# EAGLE design avoccado-avr-pcb-felina-screwholes (EAGLE 7.2.0)
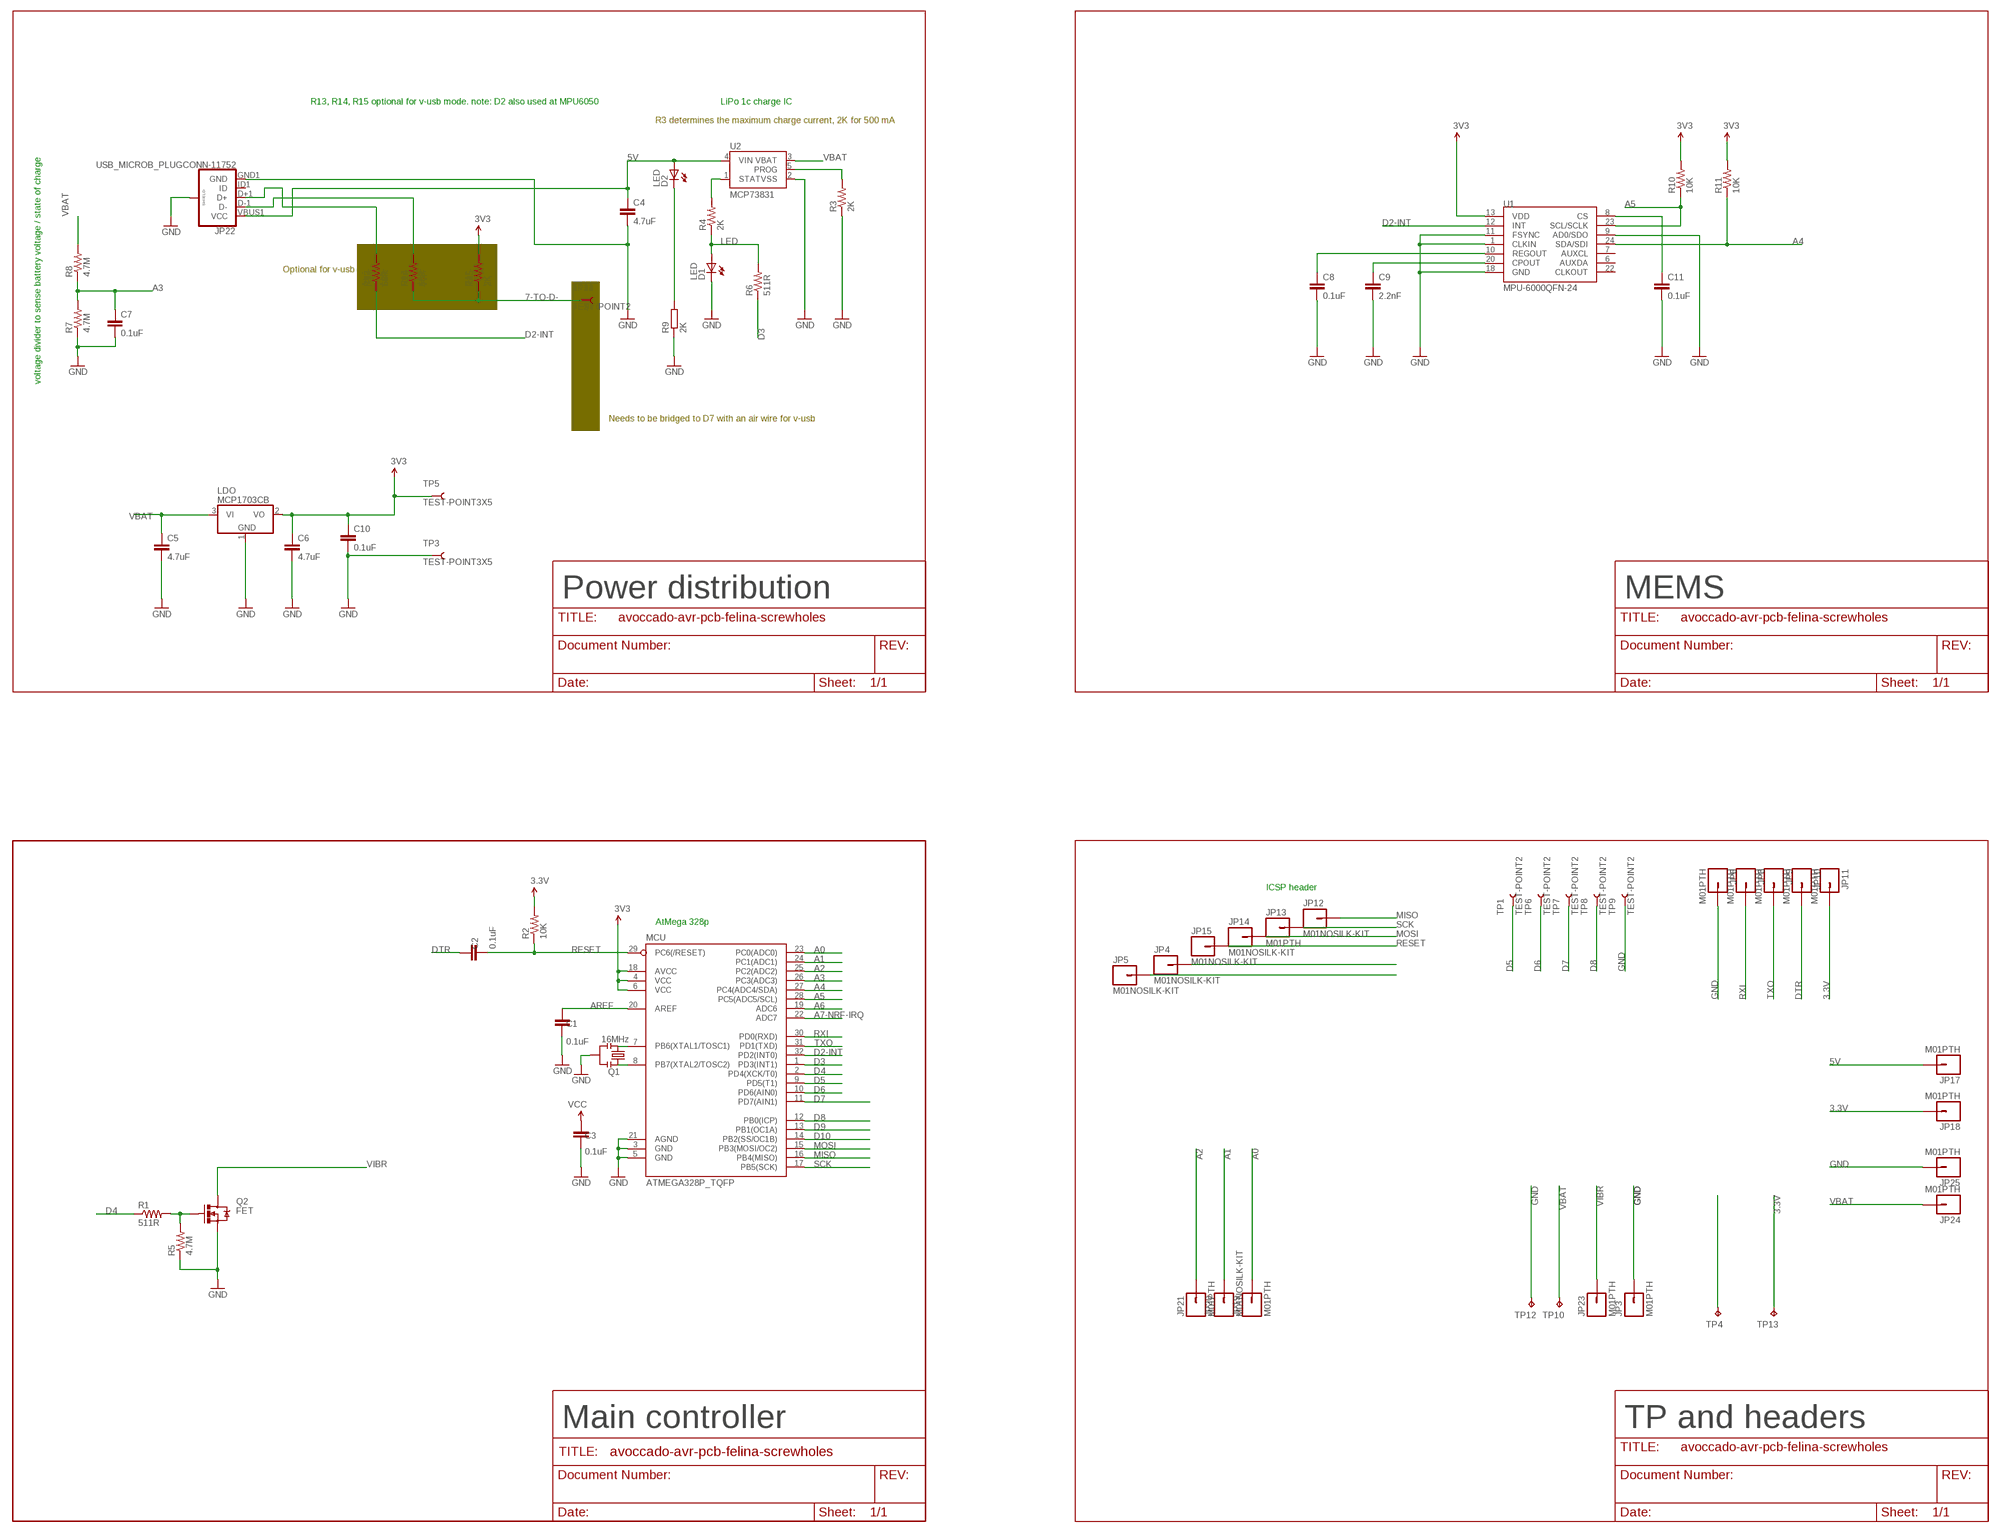
[diagram p0: schematic, sheet 1, part 1 of 2]
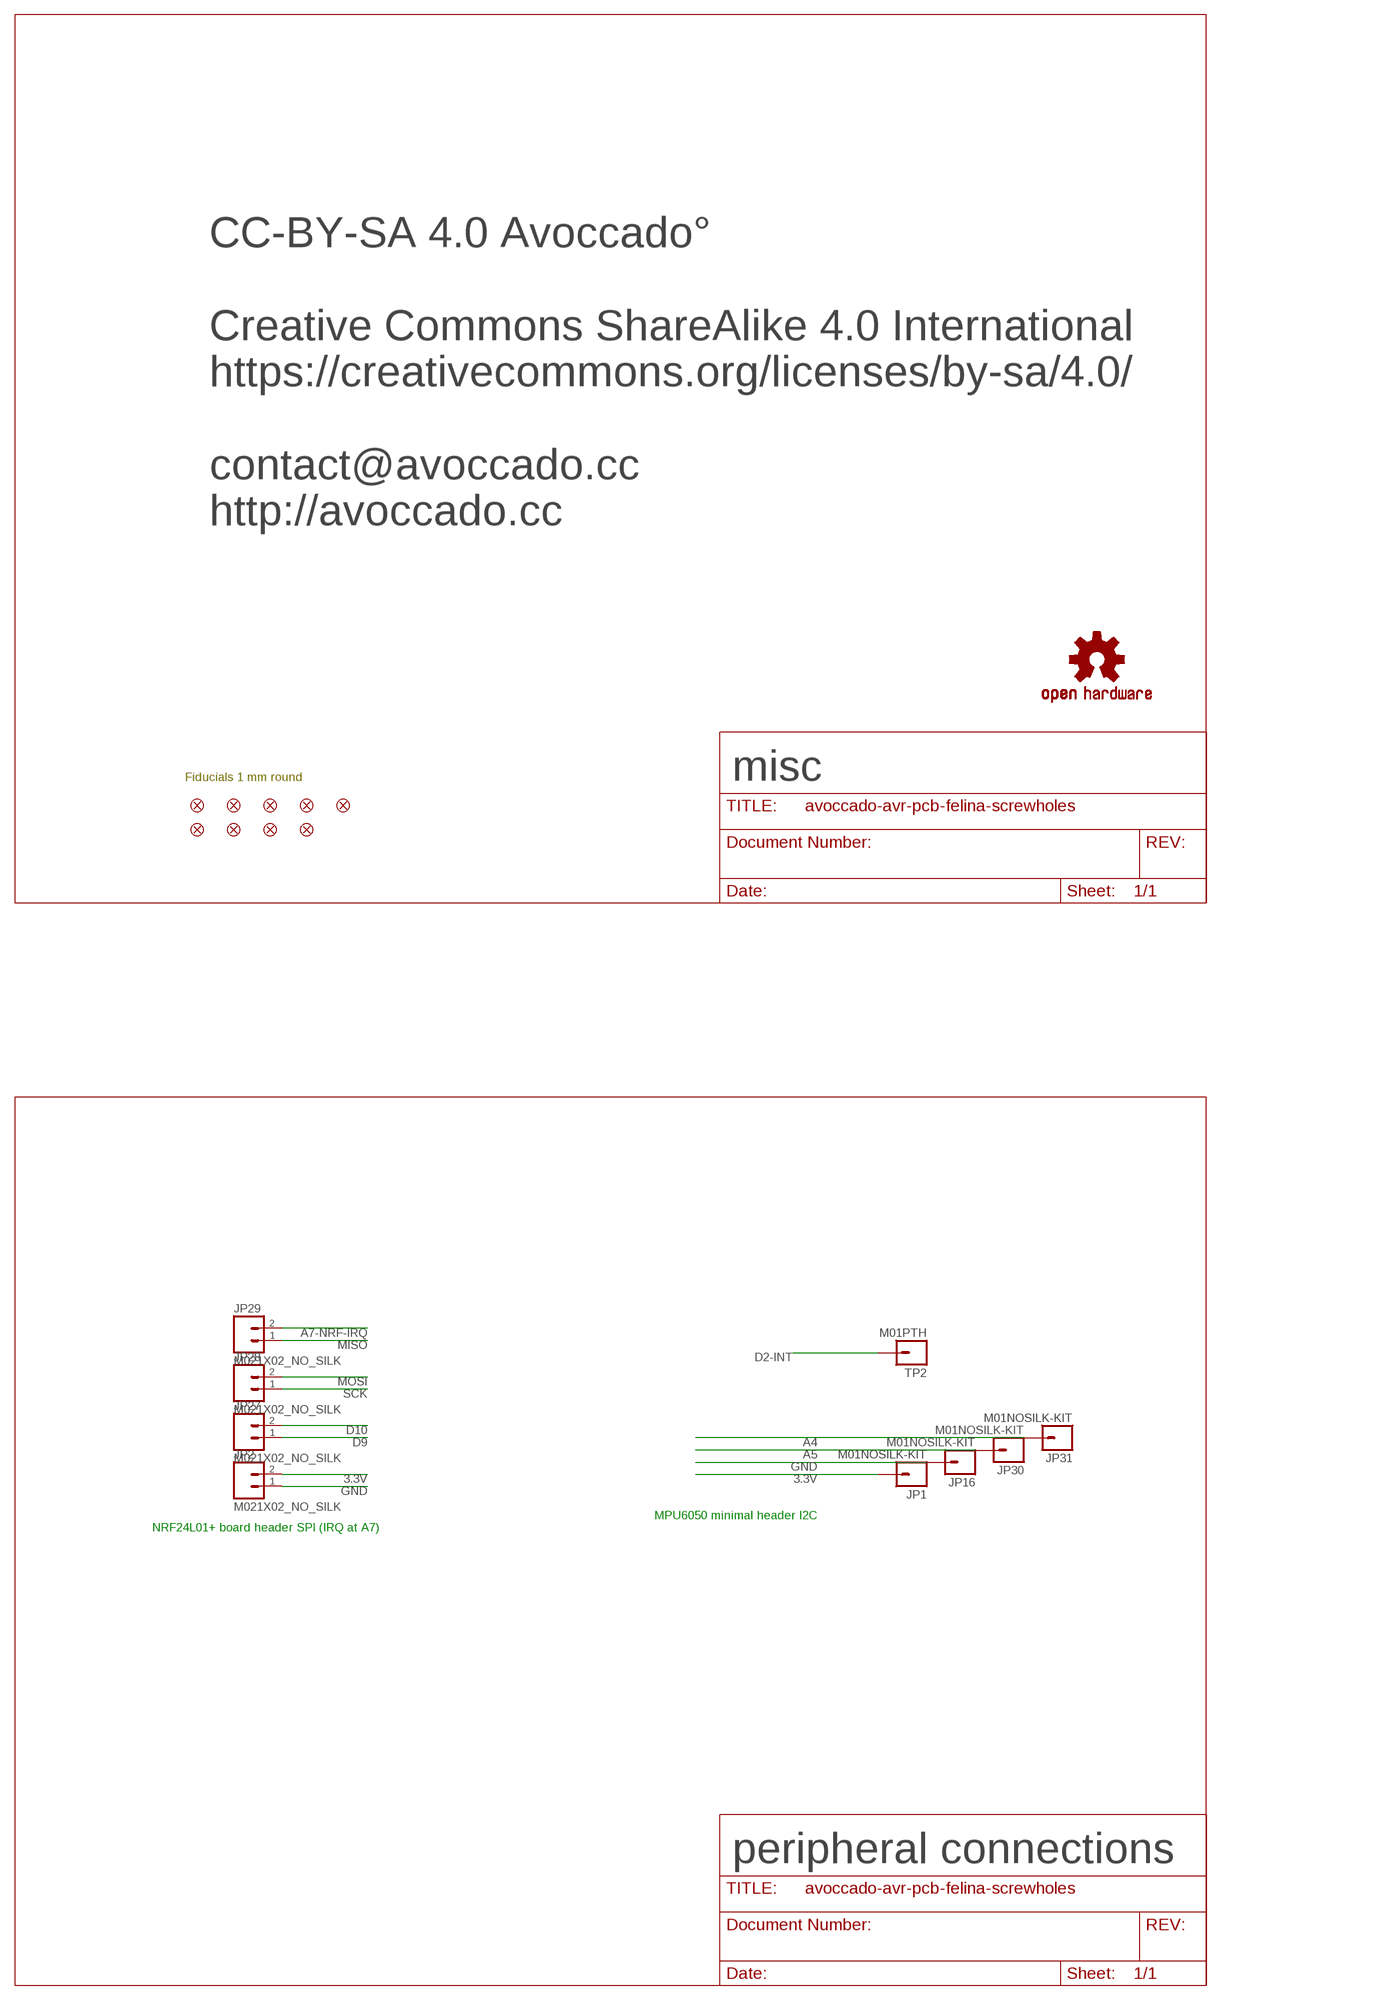
[diagram p1: schematic, sheet 1, part 2 of 2]

## Parts
C1  0.1uF  C-EUC0402K  [C0402K]
C2  0.1uF  C-EUC0402K  [C0402K]
C3  0.1uF  C-EUC0402K  [C0402K]
C4  4.7uF  4.7UF-6.3V-10%(0603)0603  [0603-CAP]
C5  4.7uF  4.7UF-6.3V-10%(0603)0603  [0603-CAP]
C6  4.7uF  4.7UF-6.3V-10%(0603)0603  [0603-CAP]
C7  0.1uF  C-EUC0402K  [C0402K]
C8  0.1uF  C-EUC0402K  [C0402K]
C9  2.2nF  C-EUC0402K  [C0402K]
C10  0.1uF  C-EUC0603  [C0603]
C11  0.1uF  C-EUC0402K  [C0402K]
D1  LED  LED0603  [LED-0603]
D2  LED  LED0603  [LED-0603]
FID1  FIDUCIALUFIDUCIAL  [MICRO-FIDUCIAL]
FID2  FIDUCIALUFIDUCIAL  [MICRO-FIDUCIAL]
FID3  FIDUCIALUFIDUCIAL  [MICRO-FIDUCIAL]
FID4  FIDUCIALUFIDUCIAL  [MICRO-FIDUCIAL]
FID5  FIDUCIALUFIDUCIAL  [MICRO-FIDUCIAL]
FID6  FIDUCIALUFIDUCIAL  [MICRO-FIDUCIAL]
FID7  FIDUCIALUFIDUCIAL  [MICRO-FIDUCIAL]
FID8  FIDUCIALUFIDUCIAL  [MICRO-FIDUCIAL]
FID9  FIDUCIALUFIDUCIAL  [MICRO-FIDUCIAL]
JP1  M01NOSILK-KIT  [1X01NS-KIT]
JP2  M021X02_NO_SILK  [1X02_NO_SILK]
JP3  M01PTH  [1X01]
JP4  M01NOSILK-KIT  [1X01NS-KIT]
JP5  M01NOSILK-KIT  [1X01NS-KIT]
JP6  M01PTH  [1X01]
JP8  M01PTH  [1X01]
JP9  M01PTH  [1X01]
JP10  M01PTH  [1X01]
JP11  M01PTH  [1X01]
JP12  M01NOSILK-KIT  [1X01NS-KIT]
JP13  M01PTH  [1X01]
JP14  M01NOSILK-KIT  [1X01NS-KIT]
JP15  M01NOSILK-KIT  [1X01NS-KIT]
JP16  M01NOSILK-KIT  [1X01NS-KIT]
JP17  M01PTH  [1X01]
JP18  M01PTH  [1X01]
JP19  M01PTH  [1X01]
JP20  M01NOSILK-KIT  [1X01NS-KIT]
JP21  M01PTH  [1X01]
JP22  USB_MICROB_PLUGCONN-11752  [USB-B-MICRO-SMD_V03]
JP23  M01PTH  [1X01]
JP24  M01PTH  [1X01]
JP25  M01PTH  [1X01]
JP27  M021X02_NO_SILK  [1X02_NO_SILK]
JP28  M021X02_NO_SILK  [1X02_NO_SILK]
JP29  M021X02_NO_SILK  [1X02_NO_SILK]
JP30  M01NOSILK-KIT  [1X01NS-KIT]
JP31  M01NOSILK-KIT  [1X01NS-KIT]
LDO  MCP1703CB  [SOT23]
LOGO1  OSHW-LOGOS  [OSHW-LOGO-S]
MCU  ATMEGA328P_TQFP  [TQFP32-08]
Q1  16MHz  RESONATORSMD  [RESONATOR-SMD]
Q2  FET  MOSFET-NCHANNELBSS123LT1G  [SOT23-3]
R1  511R  RESISTOR0603  [0603-RES]
R2  10K  RESISTOR0603  [0603-RES]
R3  2K  RESISTOR0603  [0603-RES]
R4  2K  RESISTOR0603  [0603-RES]
R5  4.7M  RESISTOR0603  [0603-RES]
R6  511R  RESISTOR0603  [0603-RES]
R7  4.7M  RESISTOR0603  [0603-RES]
R8  4.7M  RESISTOR0603  [0603-RES]
R9  2K  R-EU_R0402  [R0402]
R10  10K  RESISTOR0603  [0603-RES]
R11  10K  RESISTOR0603  [0603-RES]
R13  68R  RESISTOR0603  [0603-RES]
R14  68R  RESISTOR0603  [0603-RES]
R15  2K  RESISTOR0603  [0603-RES]
TP1  TEST-POINT2  [PAD.02X.02]
TP2  M01PTH  [1X01]
TP3  TEST-POINT3X5  [PAD.03X.05]
TP4  TPTP20R  [TP20R]
TP5  TEST-POINT3X5  [PAD.03X.05]
TP6  TEST-POINT2  [PAD.02X.02]
TP7  TEST-POINT2  [PAD.02X.02]
TP8  TEST-POINT2  [PAD.02X.02]
TP9  TEST-POINT2  [PAD.02X.02]
TP10  TPTP20R  [TP20R]
TP11  TEST-POINT2  [PAD.02X.02]
TP12  TPTP20R  [TP20R]
TP13  TPTP20R  [TP20R]
U1  MPU-6000QFN-24  [QFN-24-TESTING]
U2  MCP73831  [SOT23-5]

## Nets
3.3V: C3.2 C6.1 C10.1 JP1.1 JP2.2 JP4.1 JP11.1 JP18.1 LDO.2(VO) MCU.4(VCC) MCU.6(VCC) MCU.18(AVCC) R2.2 R10.2 R11.2 R15.2 TP5.P$1 TP13.TP U1.13(VDD) ; supply symbol labelled VCC, 3V3
5V: C4.1 D2.A JP17.1 JP22.VBUS1(VCC) U2.4(VIN)
7-TO-D-: R14.1 R15.1 TP11.P$1
A0: JP19.1 MCU.23(PC0(ADC0))
A1: JP20.1 MCU.24(PC1(ADC1))
A2: JP21.1 MCU.25(PC2(ADC2))
A3: C7.1 MCU.26(PC3(ADC3)) R7.2 R8.1
A4: JP31.1 MCU.27(PC4(ADC4/SDA)) R11.1 U1.24(SDA/SDI)
A5: JP30.1 MCU.28(PC5(ADC5/SCL)) R10.1 U1.23(SCL/SCLK)
A6: MCU.19(ADC6)
A7-NRF-IRQ: JP29.2 MCU.22(ADC7)
AREF: C1.2 MCU.20(AREF)
CHG-PROG: R3.2 U2.5(PROG)
D2-INT: MCU.32(PD2(INT0)) R13.1 TP2.1 U1.12(INT)
D3: MCU.1(PD3(INT1)) R6.1
D4: MCU.2(PD4(XCK/T0)) R1.1
D5: MCU.9(PD5(T1)) TP1.P$1
D6: MCU.10(PD6(AIN0)) TP6.P$1
D7: MCU.11(PD7(AIN1)) TP7.P$1
D8: MCU.12(PB0(ICP)) TP8.P$1
D9: JP27.1 MCU.13(PB1(OC1A))
D10: JP27.2 MCU.14(PB2(SS/OC1B))
DTR: C2.2 JP10.1
GND [vcc]: C1.1 C3.1 C4.2 C5.2 C6.2 C7.2 C8.2 C9.2 C10.2 C11.2 D1.C JP2.1 JP3.1 JP5.1 JP6.1 JP16.1 JP22.GND1(GND) JP22.SHIELD1(SHIELD) JP22.SHIELD2(SHIELD) JP22.SHIELD3(SHIELD) JP25.1 LDO.1(GND) MCU.3(GND) MCU.5(GND) MCU.21(AGND) Q1.2 Q2.2(S) R3.1 R5.1 R7.1 R9.1 TP3.P$1 TP4.TP TP9.P$1 TP12.TP U1.1(CLKIN) U1.9(AD0/SDO) U1.11(FSYNC) U1.18(GND) U2.2(VSS)
LED: D1.A R4.1 R6.2
MISO: JP12.1 JP29.1 MCU.16(PB4(MISO))
MOSI: JP14.1 JP28.2 MCU.15(PB3(MOSI/OC2))
N$1: MCU.8(PB7(XTAL2/TOSC2)) Q1.1
N$2: MCU.7(PB6(XTAL1/TOSC1)) Q1.3
N$3: D2.C R9.2
N$4: JP22.D+1(D+) R13.2
N$5: JP22.D-1(D-) R14.2
N$6: Q2.1(G) R1.2 R5.2
N$7: C8.1 U1.10(REGOUT)
N$8: C9.1 U1.20(CPOUT)
N$10: C11.1 U1.8(CS)
RESET: C2.1 JP15.1 MCU.29(PC6(/RESET)) R2.1
RXI: JP8.1 MCU.30(PD0(RXD))
SCK: JP13.1 JP28.1 MCU.17(PB5(SCK))
SOC: R4.2 U2.1(STAT)
TXO: JP9.1 MCU.31(PD1(TXD))
VBAT [vcc]: C5.1 JP24.1 LDO.3(VI) R8.2 TP10.TP U2.3(VBAT)
VIBR: JP23.1 Q2.3(D)
Unconnected: JP22.ID1(ID) U1.6(AUXDA) U1.7(AUXCL) U1.22(CLKOUT)

## Notes on the sheet
- R13, R14, R15 optional for v-usb mode. note: D2 also used at MPU6050 | LiPo 1c charge IC
- R3 determines the maximum charge current, 2K for 500 mA
- Optional for v-usb
- voltage divider to sense battery voltage / state of charge
- CC-BY-SA 4.0 Avoccado°
  
  Creative Commons ShareAlike 4.0 International
  https://creativecommons.org/licenses/by-sa/4.0/ 
  
  contact@avoccado.cc
  http://avoccado.cc
- Needs to be bridged to D7 with an air wire for v-usb
- Power distribution | MEMS | Fiducials 1 mm round | misc
- ICSP header
- AtMega 328p
- MPU6050 minimal header I2C
- NRF24L01+ board header SPI (IRQ at A7)
- Main controller | TP and headers | peripheral connections

## Library data of the parts
C1 C3 = resistor:C-EU: CAPACITOR, European symbol
C2 C7-C11 = rcl:C-EU: CAPACITOR, European symbol
C4-C6 = SparkFun-Capacitors:4.7UF-6.3V-10%(0603): CAP-08280; PROD_ID: CAP-08280
D1 D2 = SparkFun:LED: LEDs Standard schematic elements and footprints for 5mm, 3mm, 1206, and 0603 sized LEDs. 5mm - Spark Fun Electronics SKU : COM-00529 (and others)
FID1-FID9 = SparkFun-Aesthetics:FIDUCIAL: Fiducial Alignment Points Various fiducial points for machine vision alignment.
JP1 JP3-JP6 JP8-JP21 JP23-JP25 JP30 JP31 TP2 = SparkFun-Connectors:M01: Header 1 Standard 1-pin 0.1" header. Use with straight break away headers (SKU : PRT-00116), right angle break away headers (PRT-00553), swiss pins (PRT-00743), machine pins (PRT-00117), and female headers (PRT-00115).
JP2 JP27-JP29 = SparkFun-Connectors:M02: Standard 2-pin 0.1" header. Use with - straight break away headers ( PRT-00116) - right angle break away headers (PRT-00553) - swiss pins (PRT-00743) - machine pins (PRT-00117) - female headers (PRT-00115) Molex polarized connector foot print use with: PRT-08233 with associated crimp pins and housings. 2.54_SCREWTERM for use with PRT-10571. 3.5mm Screw Terminal footprints for PRT-08084 5mm Screw Terminal footprints for use with PRT-08432
JP22 = SparkFun-Connectors:USB_MICROB_PLUG: USB Micro-B connectors Some male, some female. Watch your step!; PROD_ID: CONN-11752
LDO = linear:MCP1703: 250 mA, 16V, Low Quiescent Current LDO Regulator Source: http://ww1.microchip.com/downloads/en/DeviceDoc/22049b.pdf
LOGO1 = SparkFun-Aesthetics:OSHW-LOGO: Open Source Hardware Logo This logo indicates the piece of hardware it is found on incorporates a OSHW license and/or adheres to the definition of open source hardware found here: http://freedomdefined.org/OSHW
MCU = SparkFun-DigitalIC:ATMEGA328P_TQFP; PROD_ID: IC-09069
Q1 = SparkFun:RESONATOR: Resonator Small SMD resonator. This is the itty bitty 10/20MHz resonators with built in caps. CSTCE10M0G55 and CSTCE20M0V53. Footprint has been reviewed closely but hasn't been tested yet.
Q2 = SparkFun-DiscreteSemi:MOSFET-NCHANNEL: Common NMOSFET Parts MFG P/N Store ID Prod ID FDD8780 TRANS-09984 SI7820DN TRANS-11055 FDS6630A IC-08089 2N7002PW TRANS-11151 FQP30N06L COM-10213 TRANS-10060 BSS123LT1G TRANS-08345 BSS138 TRANS-00830 BS170 2N7000; PROD_ID: TRANS-08345
R1-R8 R10 R11 R13-R15 = SparkFun-Resistors:RESISTOR: Resistor Basic schematic elements and footprints for 0603, 1206, and PTH resistors.
R9 = rcl:R-EU_: RESISTOR, European symbol
TP1 TP3 TP5-TP9 TP11 = SparkFun-Passives:TEST-POINT: Bare copper test points for troubleshooting or ICT
TP4 TP10 TP12 TP13 = testpad:TP: Test pad
U1 = SparkFun-Sensors:MPU-6000: MPU-6000 - I2C address is 0x68 with AD0 low and 0x69 with AD0 high.
U2 = SparkFun:MCP73831: Microchip's MCP73831 Miniature single cell, fully integrated Li-Ion, Li-polymer charge management controller http://ww1.microchip.com/downloads/en/DeviceDoc/21984a.pdf

## Net classes
1 vcc: width 0.203 mm
3 usbvcc: width 0.203 mm, drill 0.61 mm, clearance 0.152 mm

## Board
Avoccado PCB AVR
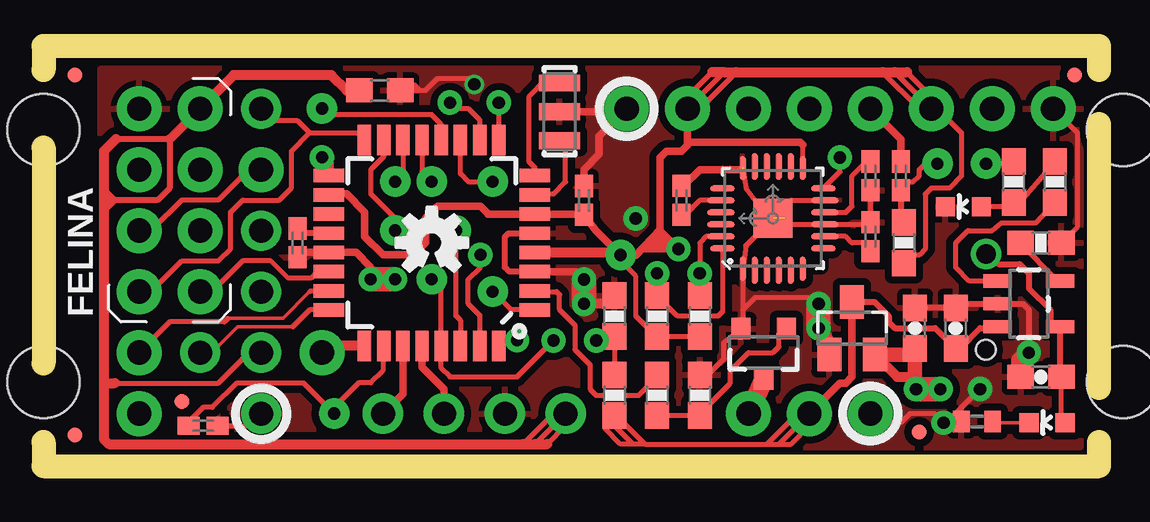
[diagram p2: board, top side]
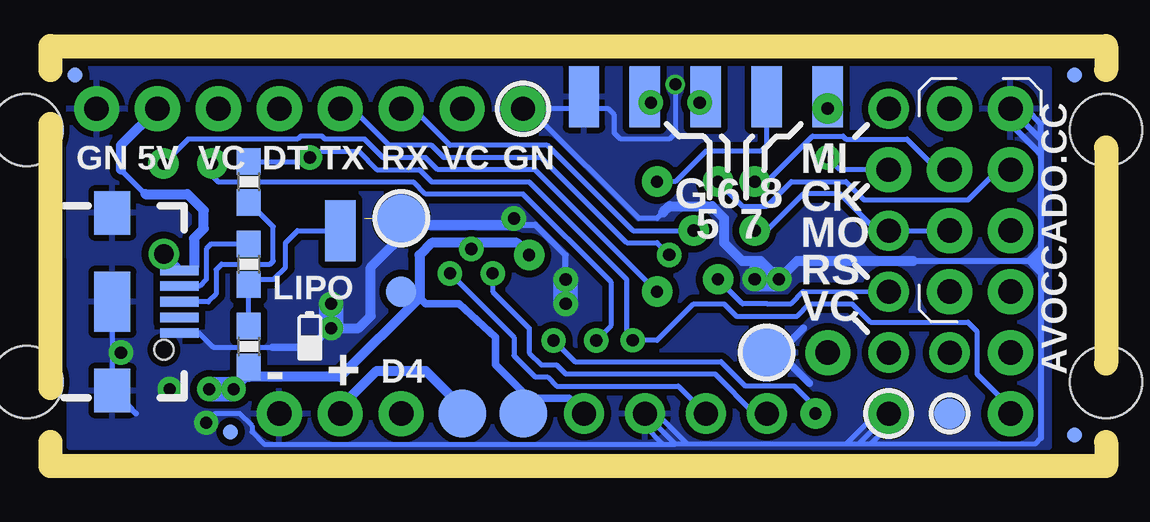
[diagram p3: board, bottom side, seen from below]

No outline drawn. Coordinates in mm, seen from the top.
Copper layers (1*16): Top 0.035mm / dielectric 1.5mm / Bottom 0.035mm
Design rules "SeeedStudio_2layer_DRU_no_angle_20140221 *": minimum track width 6mil, minimum drill 12mil, track to track 6mil, track to pad 6mil, pad to pad 6mil, via to via 6mil, smd to smd 0mil, copper to edge 10mil, drill to drill 10mil, minimum pad ring 10mil, minimum via ring 6mil, stop-mask expansion 0mil, vias tented up to drill 100mil, thermal gap 10mil
Holes 3 mm at 1.5,5 1.5,15.5 46.5,15.5 46.5,5
tRestrict: area 13.6,6.7 to 21.7,14.9; area 29.9,9.8 to 33.9,13.9; area 27.8,11.3 to 29.9,13.9
Milling: 8 lines

### Footprints (pad centres in the part's own frame; a part is rotated, then mirrored left to right if it is on the bottom)
C0402K = smd 0.925 x 0.74: 1 -0.6,0; 2 0.6,0
0603-CAP = smd 1.1 x 1: 1 -0.85,0; 2 0.85,0
C0603 = smd 1.1 x 1: 1 -0.85,0; 2 0.85,0
LED-0603 = smd 0.8 x 0.8: A 0,-0.75; C 0,0.75
MICRO-FIDUCIAL = smd 0.635 x 0.635: 1 0,0
1X01NS-KIT = drill 1 pad 1.676: 1 0,0
1X02_NO_SILK = drill 1.016 pad 1.88: 1 0,0; 2 2.54,0
1X01 = drill 1.016 pad 1.88: 1 0,0
USB-B-MICRO-SMD_V03 = smd 1.6 x 0.4: D+1 2.8,0; D-1 2.8,0.65; GND1 2.8,-1.3; ID1 2.8,-0.65; VBUS1 2.8,1.3 | smd 1.5 x 1.8: SHIELD1 0,3.7; SHIELD2 0,-3.7 | smd 1.5 x 2.5: SHIELD3 0,0 | hole 0.8: 2.15,-2
SOT23 = smd 1 x 1.4: 1 -0.95,-1.1; 2 0.95,-1.1; 3 0,1.1
TQFP32-08 = smd 1.27 x 0.559: 1 -4.293,2.8; 2 -4.293,2; 3 -4.293,1.2; 4 -4.293,0.4; 5 -4.293,-0.4; 6 -4.293,-1.2; 7 -4.293,-2; 8 -4.293,-2.8; 17 4.293,-2.8; 18 4.293,-2; 19 4.293,-1.2; 20 4.293,-0.4; 21 4.293,0.4; 22 4.293,1.2; 23 4.293,2; 24 4.293,2.8 | smd 0.559 x 1.27: 9 -2.8,-4.293; 10 -2,-4.293; 11 -1.2,-4.293; 12 -0.4,-4.293; 13 0.4,-4.293; 14 1.2,-4.293; 15 2,-4.293; 16 2.8,-4.293; 25 2.8,4.293; 26 2,4.293; 27 1.2,4.293; 28 0.4,4.293; 29 -0.4,4.293; 30 -1.2,4.293; 31 -2,4.293; 32 -2.8,4.293
RESONATOR-SMD = smd 0.7 x 1.7: 1 -1.2,0; 2 0,0; 3 1.2,0
SOT23-3 = smd 0.8 x 0.9: 1 -0.95,-1; 2 0.95,-1; 3 0,1.1
0603-RES = smd 1.1 x 1: 1 -0.85,0; 2 0.85,0
R0402 = smd 0.7 x 0.9: 1 -0.65,0; 2 0.65,0
PAD.02X.02 = smd 2.54 x 1.27: P$1 0,0
PAD.03X.05 = smd 1.27 x 1.27: P$1 0,0
TP20R = smd 2 x 2: TP 0,0
QFN-24-TESTING = smd 1.016 x 0.254: 1 -2.1,1.257; 6 -2.1,-1.25; 13 2.1,-1.25; 18 2.1,1.25 | smd 1.143 x 0.254: 2 -2.163,0.75; 3 -2.163,0.25; 4 -2.163,-0.25; 5 -2.163,-0.75; 14 2.163,-0.75; 15 2.163,-0.25; 16 2.163,0.25; 17 2.163,0.75 | smd 0.254 x 1.016: 7 -1.25,-2.1; 12 1.25,-2.1; 19 1.25,2.1; 24 -1.25,2.1 | smd 0.254 x 1.143: 8 -0.75,-2.163; 9 -0.25,-2.163; 10 0.25,-2.163; 11 0.75,-2.163; 20 0.75,2.163; 21 0.25,2.163; 22 -0.25,2.163; 23 -0.75,2.163 | smd 1.626 x 1.626: P$1 0,0
SOT23-5 = smd 0.55 x 1.2: 1 -0.95,-1.3; 2 0,-1.3; 3 0.95,-1.3; 4 0.95,1.3; 5 -0.95,1.3

### Placement (x,y rotation side)
C1  12.09,10.8 90 top
C2  37.23,13.6 90 top
C3  24.03,12.57 270 top
C4  43.08,5.22 180 top
C5  39.52,7.25 90 top
C6  37.82,7.25 90 top
C7  8.15,3.18 0 top
C8  35.97,13.6 270 top
C9  28.09,12.58 90 top
C10  15.52,17.15 0 top
C11  35.97,11.06 90 top
D1  39.84,12.31 90 top
D2  43.33,3.31 90 top
FID1  2.82,17.79 0 top
FID2  44.47,17.79 0 top
FID3  7.26,4.2 0 top
FID4  2.82,2.8 0 top
FID5  38,2.93 0 top
FID6  2.82,2.8 0 bottom
FID7  2.82,17.79 0 bottom
FID8  44.47,17.79 0 bottom
FID9  38,2.93 0 bottom
JP1  23.27,3.69 0 top
JP2  5.49,16.39 0 top
JP3  25.8,16.39 90 top
JP4  10.56,6.23 0 top
JP5  10.56,3.69 0 top
JP6  43.59,16.39 0 top
JP8  30.89,16.39 90 top
JP9  33.42,16.39 90 top
JP10  35.97,16.39 90 top
JP11  28.34,16.39 90 top
JP12  10.56,16.39 0 top
JP13  10.56,13.85 0 top
JP14  10.56,11.31 0 top
JP15  10.56,8.77 0 top
JP16  20.73,3.69 0 top
JP17  41.05,16.39 90 top
JP18  38.51,16.39 90 top
JP19  5.49,6.23 90 top
JP20  8.03,6.23 90 top
JP21  13.11,6.23 90 top
JP22  42.93,8.35 0 bottom
JP23  30.89,3.69 0 top
JP24  33.42,3.69 0 top
JP25  35.97,3.69 0 top
JP27  5.49,13.85 0 top
JP28  5.49,11.31 0 top
JP29  5.49,8.77 0 top
JP30  18.18,3.69 0 top
JP31  15.64,3.69 0 top
LDO  35.2,7.25 0 top
LOGO1  17.68,10.8 0 top
MCU  17.68,10.8 180 top
Q1  23.01,16.27 270 top
Q2  31.52,6.23 180 top
R1  27.07,4.45 270 top
R2  37.36,10.8 270 top
R3  43.08,10.8 180 top
R4  43.65,13.34 270 top
R5  28.85,4.45 270 top
R6  41.93,13.34 270 top
R7  25.3,7.76 270 top
R8  25.3,4.45 270 top
R9  40.41,3.36 0 top
R10  28.85,7.76 270 top
R11  27.07,7.76 270 top
R13  37.23,13.34 270 bottom
R14  37.23,9.91 90 bottom
R15  37.23,6.49 270 bottom
TP1  20.73,16.9 270 bottom
TP2  5.49,3.69 0 top
TP3  8.03,3.69 270 bottom
TP4  30.89,11.82 0 bottom
TP5  30.89,8.77 0 bottom
TP6  18.18,16.9 270 bottom
TP7  15.64,16.9 270 bottom
TP8  13.11,16.9 270 bottom
TP9  23.27,16.9 270 bottom
TP10  28.34,3.69 0 bottom
TP11  33.42,11.31 270 bottom
TP12  15.64,6.23 0 bottom
TP13  25.8,3.69 0 bottom
U1  31.9,11.82 90 top
U2  42.57,8.26 270 top

### Tracks (layer width: path | path; a pad name or v marks a point on that pad's centre or on a via)
3.3V  (via drill 0.51 pad 1.02, 0.51 pad 1.27)
  Top 0.203: 13.42,12.84 13.38,12.81 MCU.18 | R10.2 R11.2 27.04,6.91 26.19,7.76 26.19,9.41 25.55,10.04 v25.55,10.3 | U1.13 33.15,14.89 | 20.03,12.01 20.04,12 | 21.97,10.41 MCU.4 | 22,2.42 JP1.1 | 4.47,4.96 8.79,4.96 10.06,6.23 JP4.1 | 4.09,4.96 4.01,4.96 | 22.5,2.42 23.27,3.18 JP1.1 | 21.49,2.42 22.76,3.69 JP1.1 | JP11.1 29.87,17.92 | 28.85,16.39 30.38,17.92 | 29.36,17.92 28.34,16.9 | 36.98,17.92 JP18.1 | 37.49,17.92 38.51,16.9 JP18.1 | JP18.1 38,16.39 36.47,17.92 | 37.23,10.3 R2.2 37.83,10.3 38,10.3 38.25,10.55 38.25,12.84 38.51,13.09 39.27,13.09 39.77,13.6 39.77,15.38 38.76,16.39 JP18.1
  Top 0.254: 13.35,12.84 13.38,12.81 | 6.75,15.13 6.75,15.12 | 6.75,15.12 4.51,15.12 | 6.75,15.12 6.75,13.09 6.25,12.58 4.47,12.58 | MCU.6 22.04,12.07 | 28.85,16.39 JP11.1 28.34,16.9 | 4.47,12.58 3.96,12.07 3.96,12.58 4.47,12.58 | 4.47,12.58 3.96,13.09
  Top 0.305: 13.42,12.84 14.12,12.84 14.88,12.08 14.88,11.07 15.64,10.3 16.91,10.3 17.42,10.81 17.42,11.83 17.93,12.34 19.71,12.34 20.03,12.01 20.03,12 | 20.04,12 MCU.6 24,12 C3.2 24.54,11.31 v25.55,10.3 26.19,10.3 | 21.97,10.41 21.96,10.42 | 28.6,16.39 JP11.1 28.34,14.99 | 28.34,14.99 28.34,14.87 28.09,14.61 27.46,14.61 27.2,14.36 27.2,11.35 26.19,10.3 | 28.34,14.99 33.04,14.99 33.15,14.89 | v27.96,10.55 26.44,10.55 | 26.44,10.55 26.19,10.3 | 26.44,10.55 26.69,10.8 27.84,10.8 27.96,10.68 v27.96,10.55 | v27.96,10.55 27.2,11.31 27.2,10.93
  Top 0.381: JP2.2 6.75,15.13
  Top 0.406: 4.51,15.12 4.01,14.62 4.01,4.96 4.01,2.62 4.21,2.42 21.49,2.42 22,2.42 22.5,2.42 | v37.87,4.71 37.87,5.22 37.09,5.22 LDO.2 | 21.96,10.42 25.42,10.42 v25.55,10.3 | 4.09,4.96 4.47,4.96 | C10.1 14.12,17.15 13.49,17.79 9.42,17.79 JP2.2 | 29.36,17.92 29.87,17.92 30.38,17.92 36.47,17.92 36.98,17.92 37.49,17.92
  Top 0.61: C6.1 37.82,5.26 v37.87,4.71 | LDO.2 37.42,6.15 37.59,6.32
  Top 1.016: v37.87,4.71 v38.89,4.71
  Bottom 0.152: 28.09,10.8 28.09,10.68 v27.96,10.55
  Bottom 0.254: R15.2 37.23,5.22
  Bottom 0.305: JP1.1 23.9,4.33 25.55,4.33 | 25.55,4.33 26.95,5.72 26.95,6.87 28.47,8.26 29.87,8.26 30.12,8.52 | TP13.TP 25.8,4.07 25.55,4.33 | TP5.P$1 30.12,8.77
  Bottom 0.406: v25.55,10.3 26.06,10.8 28.09,10.8 29.61,10.8 30.12,10.3 30.12,8.77 30.12,8.52 33.42,5.22 37.23,5.22 37.36,5.22 v37.87,4.71
  Bottom 1.016: v38.89,4.71 38,4.71
5V  (via drill 0.81 pad 1.27)
  Top 0.152: 43.93,3.54 43.93,3.46 D2.A
  Top 0.203: 43.93,3.54 C4.1
  Top 0.254: v40.78,10.35 40.87,10.35 41.3,9.91 42.19,9.91 42.57,9.53 42.57,8.9 43.46,8.01 43.46,7.31 U2.4 43.87,5.22 C4.1
  Bottom 0.203: 39.52,9.79 39.66,9.65 JP22.VBUS1 40.15,9.65 | 42.57,13.85 41.55,12.84
  Bottom 0.406: 39.52,9.79 39.52,10.99 39.12,11.4 39.12,12.16 39.79,12.84 41.55,12.84 | JP17.1 42.57,14.87 42.57,13.85 | v40.78,10.35 40.15,9.65
7-TO-D-
  Bottom 0.203: R15.1 R14.1 37.02,9.28 36.22,9.28 35.71,9.79 35.71,10.8 35.2,11.31 TP11.P$1
A0
  Top 0.152: 12.6,8.78 11.48,7.66 9.19,7.66
  Top 0.203: 13.38,8.81 13.35,8.78 | 13.35,8.78 12.6,8.78 | 9.19,7.66 9.04,7.51 6.75,7.51 JP19.1 | MCU.23 13.36,8.78 13.35,8.78
A1
  Top 0.152: 11.89,7.31 9.6,7.31 8.53,6.24
  Top 0.203: 11.89,7.31 12.59,8.01 13.38,8.01 MCU.24 | 8.53,6.24 JP20.1
A2
  Top 0.203: MCU.25
  Top 0.406: MCU.25 13.38,6.52 JP21.1
A3  (via drill 0.51 pad 1.02, 0.51 pad 1.27)
  Top 0.203: MCU.26 15.64,6.49 | 15.64,6.49 15.64,5.48 15.14,4.97 14.63,4.97 13.61,3.95 v13.61,3.69 12.34,4.96 9.55,4.96 8.53,3.95 8.15,3.95 7.55,3.35 C7.1 | R8.1 R7.2 25.13,6.74 v24.54,6.74 | MCU.26 15.65,6.49 15.64,6.49
  Bottom 0.203: v24.54,6.74 23.65,5.85 17.55,5.85 16.53,4.83 14.5,4.83 13.61,3.95 v13.61,3.69
A4  (via drill 0.51 pad 1.02)
  Top 0.203: U1.24 29.8,7.94 29.61,7.76 27.93,7.76 R11.1 27.16,8.61 v27.07,9.53
  Top 0.305: MCU.27 16.48,4.52 JP31.1
  Bottom 0.203: JP31.1 16.15,3.69 17.8,5.34 24.03,5.34 24.41,5.72 25.04,5.72 25.55,6.23 25.55,7.25 27.07,8.77 v27.07,9.53
A5  (via drill 0.51 pad 1.02)
  Top 0.203: 28.85,8.86 R10.1 v28.85,9.53 28.85,10.8 29.12,11.07 U1.23
  Top 0.305: MCU.28 17.28,5.62 18.18,4.71 JP30.1
  Bottom 0.203: v28.85,9.53 26.19,6.87 26.19,6.11 25.3,5.22 24.79,5.22 24.41,4.83 19.33,4.83 JP30.1
A7-NRF-IRQ
  Top 0.178: 11.66,9.36 10.97,10.05
  Top 0.203: 10.97,10.05 9.8,10.05 8.53,8.78 JP29.2 | 11.66,9.36 12.68,9.36 12.85,9.53 13.31,9.53 MCU.22
AREF
  Top 0.254: MCU.20 12.35,11.2 C1.2
CHG-PROG
  Top 0.203: U2.5 43.93,9.27 43.72,9.27 42.23,10.77 R3.2
D2-INT  (via drill 0.51 pad 1.02)
  Top 0.203: v21.23,6.75 20.71,6.75 MCU.32 | U1.12 34.7,13.76 v34.7,14.36
  Bottom 0.203: TP2.1 5.49,3.95 6.88,5.34 6.88,7.12 7.26,7.5 11.33,7.5 12.09,8.26 13.87,8.26 14.38,7.76 16.91,7.76 17.42,8.26 18.69,8.26 20.22,6.74 20.23,6.75 v21.23,6.75 21.49,7 21.49,9.28 25.55,13.34 29.61,13.34 30.12,13.85 31.9,13.85 32.66,14.61 34.44,14.61 v34.7,14.36 34.86,14.19 R13.1
D3  (via drill 0.51 pad 1.27)
  Top 0.203: 21.49,8.01 | 21.49,8.01 21.97,8.01 MCU.1 | 21.49,8.01 20.98,8.01 v20.22,8.77 | R6.1 42.1,14.11 v40.79,14.11
  Bottom 0.203: v20.22,8.77 25.3,13.85 29.36,13.85 29.87,14.36 31.65,14.36 32.41,15.12 34.06,15.12 34.19,15.25 35.08,15.25 35.2,15.12 39.77,15.12 v40.79,14.11
D4
  Top 0.203: MCU.2 22,8.77 22.88,8.77 23.01,8.64 23.01,8.01 23.65,7.38 23.65,6.36 24.28,5.72 24.28,4.71 24.54,4.45 26.31,4.45 27.07,5.22 R1.1 26.99,5.3
D5  (via drill 0.51 pad 1.02)
  Top 0.203: MCU.9 v20.48,16.65
  Bottom 0.406: v20.48,16.65 TP1.P$1
D6  (via drill 0.51 pad 1.02)
  Top 0.203: MCU.10 19.68,15.92 19.21,16.39 18.69,16.39 v18.44,16.65
  Bottom 0.203: v18.44,16.65 TP6.P$1
D7  (via drill 0.51 pad 1.27)
  Top 0.203: v20.22,13.35 19.2,13.35 18.88,13.68 MCU.11
  Bottom 0.203: v20.22,13.35 19.45,13.35 18.18,14.62 15.89,14.62 15.64,14.87 TP7.P$1
D8  (via drill 0.51 pad 1.27)
  Top 0.203: MCU.12 18.08,15.75 17.68,16.15 13.36,16.15 v13.11,16.4
  Bottom 0.61: TP8.P$1 v13.11,16.4
D9  (via drill 0.51 pad 1.27)
  Top 0.203: v17.68,13.35 17.28,13.75 MCU.13
  Bottom 0.203: JP27.1 5.99,13.86 7.26,12.59 11.58,12.59 12.34,13.35 14.63,13.35 15.64,12.34 16.66,12.34 v17.68,13.35
D10  (via drill 0.51 pad 1.27)
  Top 0.203: v16.15,13.35 16.48,13.68 MCU.14
  Bottom 0.203: v16.15,13.35 15.64,13.35 13.74,15.26 12.47,15.26 12.34,15.13 9.8,15.13 8.53,13.86 JP27.2
DTR
  Top 0.305: C2.2 37.23,15.12 JP10.1
GND  (via drill 0.51 pad 0.81, 0.51 pad 1.02)  (2 unrouted)
  Top 0.203: 30.64,8.01 U1.1 30.77,10.69 31.9,11.82 31.9,11.57 30.78,13.07 U1.18 | 30.64,8.01 30.64,7.43 Q2.2 29.87,6.66 29.87,5.98 29.2,5.3 R5.1 | 34.01,12.58 U1.11 32.65,12.57 32.41,12.33 32.41,11.82 32.66,11.57 34,11.57 U1.9 35.57,11.57 C11.2 C8.2 35.82,12.95 | v33.81,8.26 33.68,8.52 31.15,8.52 30.64,8.01 | C7.2 10.06,3.18 JP5.1 | C10.2 16.66,17.15 | v19.45,17.41 19.2,17.66 17.93,17.66 17.42,17.15 17.17,17.15 | 16.66,17.15 16.91,17.41 17.17,17.15 | 16.66,17.15 17.17,17.15 | 36.47,3.18 36.35,3.31 37.23,3.31 37.62,3.69 38.63,3.69 v39.01,3.31 39.14,3.31 v40.54,4.71 | R3.1 44.6,11.48 44.6,15.38 JP6.1
  Top 0.254: MCU.3 20.91,9.6 20.73,9.79 20.73,11.06 20.87,11.2 MCU.5 | C6.2 C5.2 39.69,8.26 U2.2 42.31,8.26 42.57,8.01 v42.57,6.23 42.23,5.89
  Top 0.305: v15.14,9.29 15.14,9.79 14.52,10.41 13.39,10.41 MCU.21 12.36,10.4 C1.1 | MCU.3 23.7,9.6 v24.03,9.28 | C9.2 28.18,13.18 28.85,13.85 30.58,13.85 | LDO.1 33.93,6.47 v33.81,7.25 | C3.1 24.03,13.85 24.66,14.49 24.66,15.25 JP3.1 25.68,16.27 Q1.2
  Top 0.406: R7.1 24.95,8.26 v24.03,8.26 | v33.81,7.25 34.19,6.87 34.19,5.98 | 36.35,3.31 JP25.1
  Top 0.813: 42.23,5.89 C4.2
  Top 1.016: v15.14,9.29 v16.15,9.29 | v24.03,9.28 v24.03,8.26 | v33.81,7.25 v33.81,8.26
  Bottom 0.203: 19.96,12.07 20.22,11.82 20.98,11.82 25.3,16.14 JP3.1 23.77,16.39 TP9.P$1 22.76,16.39 22.25,16.39 22,16.14 22,15.38 21.74,15.12 19.71,15.12 19.45,15.38 v19.45,17.41 | 4.21,2.68 4.47,2.42 11.33,2.42 | 11.84,2.42 12.34,2.42 | 12.34,2.42 18.95,2.42 | 18.95,2.42 19.45,2.42 | 19.45,2.42 JP16.1 | 19.96,2.42 36.6,2.42 37.11,2.93 37.11,3.18 37.62,3.69 38.63,3.69 v39.01,3.31 | 19.96,2.42 19.45,2.42 | 18.95,2.42 20.22,3.69 JP16.1 | 19.96,2.42 20.73,3.18 JP16.1 | JP5.1 11.84,2.42 | JP5.1 10.56,3.18 11.33,2.42 | 11.33,2.42 11.84,2.42 | JP5.1 11.07,3.69 12.34,2.42 | 36.25,6.46 38.73,6.46 39.32,7.05 JP22.GND1 | JP22.SHIELD3 JP22.SHIELD2 42.89,4.65 42.25,4.01
  Bottom 0.254: JP2.1 5.49,15.77 4.21,14.49 | 4.21,14.49 4.21,10.56 | 4.21,9.54 4.21,2.68 | 9.55,10.05 4.72,10.05 | 4.72,10.05 4.47,10.3 | 4.47,10.3 4.21,10.56 | 4.72,10.05 4.47,9.8 | 4.47,9.8 4.21,9.54 | 4.21,10.56 4.21,10.3 | 4.21,10.3 4.47,10.05 4.47,9.8 | 4.21,9.54 4.21,10.3 | 4.21,10.3 4.47,10.3 | v24.03,9.28 24.03,10.3 25.3,11.57 26.06,11.57 | JP2.1 4.21,15.12 | 4.21,15.12 4.21,14.49 | 4.21,15.12 4.21,15.76 4.85,16.39 JP2.1 | 42.51,4.26 42.25,4.01 41.93,3.69
  Bottom 0.305: 42.51,4.26 42.57,4.2 | 36.25,6.46 34.73,6.46 v33.81,7.25 | 15.14,6.23 13.87,4.96 | TP12.TP 15.14,6.23 | 15.14,6.23 14.12,7.25
  Bottom 0.406: 19.96,12.07 19.7,12.34 17.93,12.34 17.42,11.83 17.42,10.8 16.66,10.04 15.89,10.04 v15.14,9.29 14.38,10.05 9.55,10.05 | v16.15,9.29 16.15,9.79 | v33.81,7.25 32.66,7.25 32.16,7.76 32.16,9.79 30.38,11.57 26.06,11.57
  Bottom 1.016: v24.03,8.26 v24.03,9.28 | v15.14,9.29 v16.15,9.29 | v33.81,8.26 v33.81,7.25
  other vias: 26.19,11.82
  pour Bottom (isolate 0.279): 3.85,18.06 44.76,18.06 44.74,2.29 3.85,2.29
  pour Top (isolate 0.305): 3.85,18.06 3.85,2.29 44.74,2.29 44.74,18.07 24.95,18.06
LED
  Top 0.203: 40.59,12.38 D1.A 42.02,12.31 42.2,12.49 | R4.1 42.2,12.49 | 42.2,12.49 R6.2
MISO
  Top 0.203: 14.88,14.62 MCU.16 | 12.6,15.38 14.6,15.38 MCU.16 | JP29.1 5.99,8.78 7.26,10.05 8.79,10.05 9.29,10.56 9.29,12.08 9.8,12.59 11.33,12.59 11.84,13.1 11.84,14.62 12.6,15.38 | 12.6,15.38 12.09,15.89 11.07,15.89 JP12.1 | MCU.16
MOSI  (via drill 0.51 pad 1.27)
  Top 0.203: v16.15,11.32 16.15,11.83 15.14,12.84 15.14,13.86 15.68,14.4 MCU.15
  Bottom 0.203: v16.15,11.32 15.64,11.32 14.12,12.84 12.6,12.84 11.07,11.32 JP14.1 JP28.2 8.28,11.32
N$1
  Top 0.203: MCU.8 21.97,13.96 21.74,14.18 21.74,16.9 22.43,17.59 Q1.1
N$2
  Top 0.203: MCU.7 22,12.84 22.76,12.84 23.27,13.34 23.27,14.94 Q1.3
N$3
  Top 0.152: D2.C 41.11,3.31 R9.2
N$4
  Bottom 0.203: R13.2 36.22,11.48 36.22,10.04 36.35,9.91 38.38,9.91 38.61,9.69 38.61,8.67 38.93,8.35 JP22.D+1
N$5
  Bottom 0.203: R14.2 38.8,10.77 39.01,10.55 39.01,9.28 39.29,9 JP22.D-1
N$6
  Top 0.203: 27.24,3.6 R1.2 R5.2 28.85,3.69 30.12,4.96 30.12,5.47 30.89,6.23 31.9,6.23 32.16,6.49 32.16,7.04 Q2.1
N$7
  Top 0.203: U1.10 34.01,12.07 34.95,12.07 35.2,12.33 35.2,13.6 36.11,14.5 C8.1
N$8
  Top 0.203: U1.20 28.84,12.57 28.25,11.98 C9.1
N$10
  Top 0.203: C11.1 35.62,10.8 35.2,10.8 34.94,11.07 U1.8
RESET  (via drill 0.51 pad 1.02, 0.51 pad 1.27)
  Top 0.203: v17.68,9.29 18.08,8.89 MCU.29 18.08,5.59 18.44,5.22 21.24,5.22 v22.76,6.74 | C2.1 37.58,13.34 37.74,13.34 38,13.6 38,13.85 38.25,14.11 v38.76,14.11
  Top 0.254: C2.1 37.23,11.91 R2.1
  Bottom 0.203: JP15.1 14.12,8.78 14.63,8.27 15.64,8.27 16.65,8.26 17.17,8.77 v17.68,9.28 v17.68,9.29 | v22.76,6.74 22.12,7.38 22.12,9.15 25.8,12.84 29.87,12.84 30.38,13.34 38.51,13.34 38.76,13.6 v38.76,14.11
RXI  (via drill 0.51 pad 1.27)
  Top 0.203: MCU.30 18.88,7.58 18.69,7.76 v18.69,11.32
  Bottom 0.203: v18.69,11.32 18.7,11.31 21.23,11.31 21.23,11.32 21.24,11.32 24.79,14.87 28.85,14.87 30.38,16.39 JP8.1
SCK  (via drill 0.51 pad 1.02)
  Top 0.203: JP28.1 5.99,11.32 7.26,12.59 8.79,12.59 10.06,13.86 JP13.1 | 13.38,13.61 MCU.17
  Top 0.406: v13.11,14.37 13.39,14.11 13.38,13.61
  Bottom 0.203: JP13.1 12.6,13.86 v13.11,14.37
SOC
  Top 0.203: U2.1 40.09,9.21 39.52,9.79 39.52,10.8 40.03,11.31 41.05,11.31 41.43,11.63 42.85,11.63 R4.2
TXO  (via drill 0.51 pad 1.02)
  Top 0.203: MCU.31 19.68,7.8 19.2,8.27 19.2,9.29 19.71,9.8 v19.71,10.3
  Bottom 0.203: JP9.1 32.92,16.39 31.39,14.87 29.61,14.87 29.11,14.36 25.04,14.36 21.49,10.81 20.22,10.81 v19.71,10.3
VBAT
  Top 0.203: R8.2 25.39,3.6 26.57,2.42 | 26.57,2.42 31.65,2.42 | 31.65,2.42 32.16,2.42 | 32.16,2.42 JP24.1 | 32.16,2.42 32.66,2.42 33.42,3.18 JP24.1 | 31.65,2.42 32.92,3.69 JP24.1 | 26.57,2.42 26.06,2.42 | 26.06,2.42 25.3,3.18 25.3,3.44 | 26.06,2.42 25.55,2.42 24.92,3.06 24.92,3.56
  Top 0.254: LDO.3 36.13,8.35 36.73,7.76 36.73,7.5 36.98,7.25 38.67,7.25 C5.1 39.69,6.4 40.54,7.25 41.2,7.25 U2.3
  Top 0.305: JP24.1 34.7,4.96 34.95,4.96 35.2,5.22 LDO.3
  Bottom 0.406: JP24.1 33.42,3.95 31.9,5.47 29.87,5.47 28.34,3.95 TP10.TP
VIBR
  Top 0.813: Q2.3 JP23.1

### Text on the board
tPlace: FELINA
bPlace: GN | VC | RX | TX | DT | VC | 5V | GN | MI | CK | 8 | 6 | G | 7 | 5 | MO | RS | LIPO | VC | D4 | + | - | AVOCCADO.CC